# Altium schematic sheet IR-ARRAY.SchDoc
size A; SheetNumber: 2; SheetTotal: 2
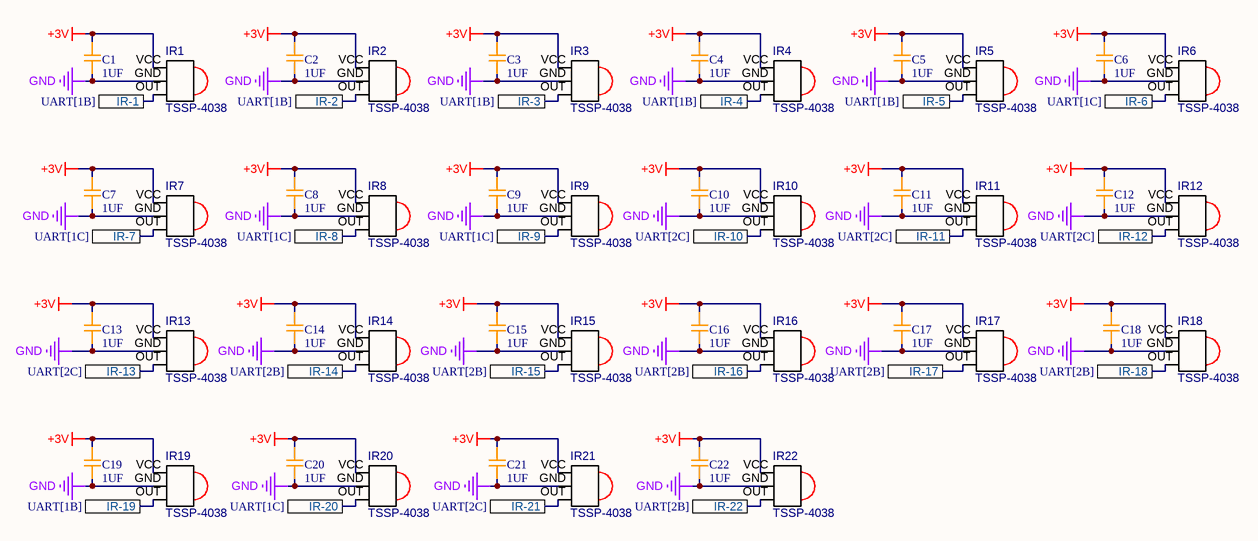
[diagram p0: IR-ARRAY.SchDoc]

## Parts
C1  1UF  [CAP_0603]
C2  1UF  [CAP_0603]
C3  1UF  [CAP_0603]
C4  1UF  [CAP_0603]
C5  1UF  [CAP_0603]
C6  1UF  [CAP_0603]
C7  1UF  [CAP_0603]
C8  1UF  [CAP_0603]
C9  1UF  [CAP_0603]
C10  1UF  [CAP_0603]
C11  1UF  [CAP_0603]
C12  1UF  [CAP_0603]
C13  1UF  [CAP_0603]
C14  1UF  [CAP_0603]
C15  1UF  [CAP_0603]
C16  1UF  [CAP_0603]
C17  1UF  [CAP_0603]
C18  1UF  [CAP_0603]
C19  1UF  [CAP_0603]
C20  1UF  [CAP_0603]
C21  1UF  [CAP_0603]
C22  1UF  [CAP_0603]
IR1  TSSP-4038  [TSSP-4038]
IR2  TSSP-4038  [TSSP-4038]
IR3  TSSP-4038  [TSSP-4038]
IR4  TSSP-4038  [TSSP-4038]
IR5  TSSP-4038  [TSSP-4038]
IR6  TSSP-4038  [TSSP-4038]
IR7  TSSP-4038  [TSSP-4038]
IR8  TSSP-4038  [TSSP-4038]
IR9  TSSP-4038  [TSSP-4038]
IR10  TSSP-4038  [TSSP-4038]
IR11  TSSP-4038  [TSSP-4038]
IR12  TSSP-4038  [TSSP-4038]
IR13  TSSP-4038  [TSSP-4038]
IR14  TSSP-4038  [TSSP-4038]
IR15  TSSP-4038  [TSSP-4038]
IR16  TSSP-4038  [TSSP-4038]
IR17  TSSP-4038  [TSSP-4038]
IR18  TSSP-4038  [TSSP-4038]
IR19  TSSP-4038  [TSSP-4038]
IR20  TSSP-4038  [TSSP-4038]
IR21  TSSP-4038  [TSSP-4038]
IR22  TSSP-4038  [TSSP-4038]

## Ports
IR-1 (see UART[1B]), IR-2 (see UART[1B]), IR-3 (see UART[1B]), IR-4 (see UART[1B]), IR-5 (see UART[1B]), IR-6 (see UART[1C]), IR-7 (see UART[1C]), IR-8 (see UART[1C]), IR-9 (see UART[1C]), IR-10 (see UART[2C]), IR-11 (see UART[2C]), IR-12 (see UART[2C]), IR-13 (see UART[2C]), IR-14 (see UART[2B]), IR-15 (see UART[2B]), IR-16 (see UART[2B]), IR-17 (see UART[2B]), IR-18 (see UART[2B]), IR-19 (see UART[1B]), IR-20 (see UART[1C]), IR-21 (see UART[2C]), IR-22 (see UART[2B])

## Nets
+3V: C1.1 C2.1 C3.1 C4.1 C5.1 C6.1 C7.1 C8.1 C9.1 C10.1 C11.1 C12.1 C13.1 C14.1 C15.1 C16.1 C17.1 C18.1 C19.1 C20.1 C21.1 C22.1 IR1.VCC IR2.VCC IR3.VCC IR4.VCC IR5.VCC IR6.VCC IR7.VCC IR8.VCC IR9.VCC IR10.VCC IR11.VCC IR12.VCC IR13.VCC IR14.VCC IR15.VCC IR16.VCC IR17.VCC IR18.VCC IR19.VCC IR20.VCC IR21.VCC IR22.VCC
GND: C1.2 C2.2 C3.2 C4.2 C5.2 C6.2 C7.2 C8.2 C9.2 C10.2 C11.2 C12.2 C13.2 C14.2 C15.2 C16.2 C17.2 C18.2 C19.2 C20.2 C21.2 C22.2 IR1.GND IR2.GND IR3.GND IR4.GND IR5.GND IR6.GND IR7.GND IR8.GND IR9.GND IR10.GND IR11.GND IR12.GND IR13.GND IR14.GND IR15.GND IR16.GND IR17.GND IR18.GND IR19.GND IR20.GND IR21.GND IR22.GND
IR-1: IR1.OUT ; port IR-1
IR-2: IR2.OUT ; port IR-2
IR-3: IR3.OUT ; port IR-3
IR-4: IR4.OUT ; port IR-4
IR-5: IR5.OUT ; port IR-5
IR-6: IR6.OUT ; port IR-6
IR-7: IR7.OUT ; port IR-7
IR-8: IR8.OUT ; port IR-8
IR-9: IR9.OUT ; port IR-9
IR-10: IR10.OUT ; port IR-10
IR-11: IR11.OUT ; port IR-11
IR-12: IR12.OUT ; port IR-12
IR-13: IR13.OUT ; port IR-13
IR-14: IR14.OUT ; port IR-14
IR-15: IR15.OUT ; port IR-15
IR-16: IR16.OUT ; port IR-16
IR-17: IR17.OUT ; port IR-17
IR-18: IR18.OUT ; port IR-18
IR-19: IR19.OUT ; port IR-19
IR-20: IR20.OUT ; port IR-20
IR-21: IR21.OUT ; port IR-21
IR-22: IR22.OUT ; port IR-22

## Library data of the parts
C1-C22 = CAP_0603: Capacitor SMD 0603 generic